# EAGLE schematic twip-pb1 (EAGLE 9.1.3)
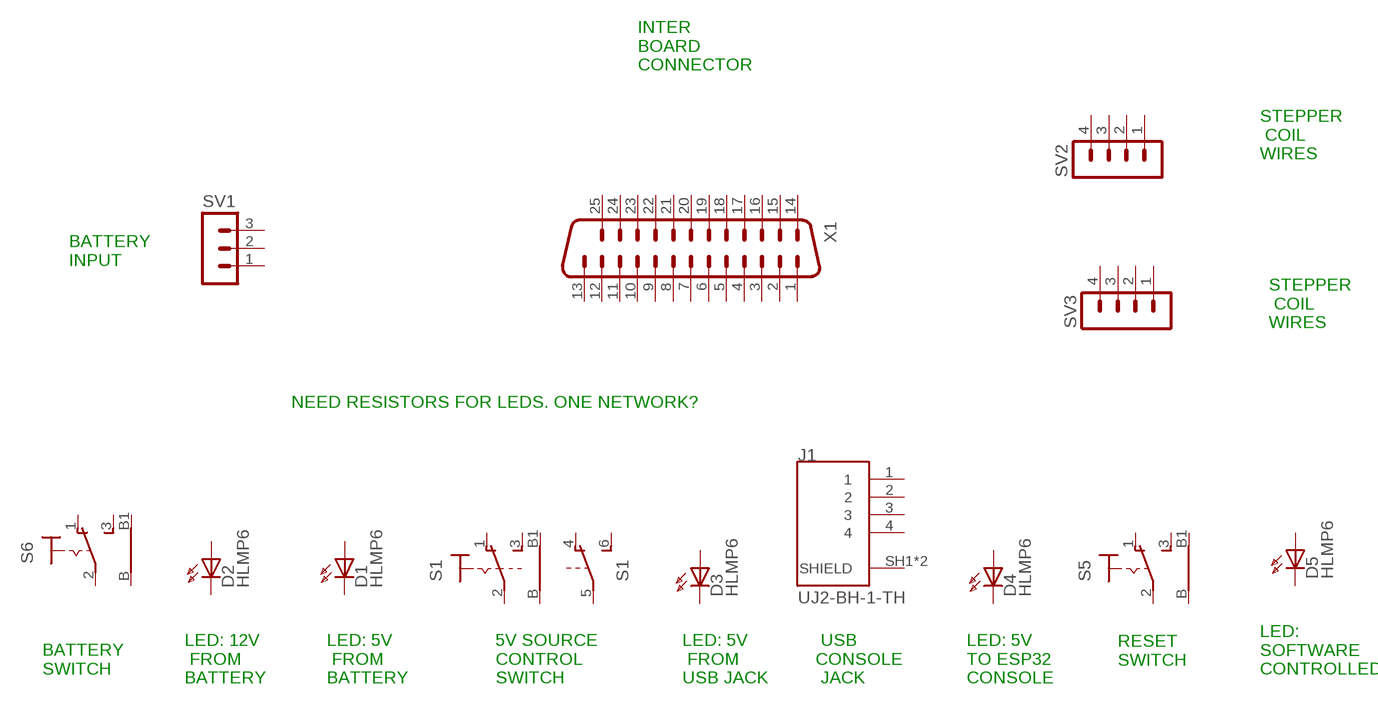
[diagram p0: schematic, sheet 1]

## Parts
D1  HLMP6  [HLMP6]
D2  HLMP6  [HLMP6]
D3  HLMP6  [HLMP6]
D4  HLMP6  [HLMP6]
D5  HLMP6  [HLMP6]
J1  UJ2-BH-1-TH  [CUI_UJ2-BH-1-TH]
S1  9070-2W  [9070-2W]
S5  9070-1W  [9070-1W]
S6  9070-1W  [9070-1W]
SV1  MA03-1  [MA03-1]
SV2  MA04-1  [MA04-1]
SV3  MA04-1  [MA04-1]
X1  M25VP  [M25VP]
Unconnected: D1.A D1.K D2.A D2.K D3.A D3.K D4.A D4.K D5.A D5.K J1.1 J1.2 J1.3 J1.4 J1.SH1(SHIELD) J1.SH2(SHIELD) S1.1(1:O) S1.2(1:P) S1.3(1:S) S1.4(B:O) S1.5(B:P) S1.6(B:S) S1.B1(1:B1) S1.B(1:B) S5.1(O) S5.2(P) S5.3(S) S5.B S5.B1 S6.1(O) S6.2(P) S6.3(S) S6.B S6.B1 SV1.1 SV1.2 SV1.3 SV2.1 SV2.2 SV2.3 SV2.4 SV3.1 SV3.2 SV3.3 SV3.4 X1.1 X1.2 X1.3 X1.4 X1.5 X1.6 X1.7 X1.8 X1.9 X1.10 X1.11 X1.12 X1.13 X1.14 X1.15 X1.16 X1.17 X1.18 X1.19 X1.20 X1.21 X1.22 X1.23 X1.24 X1.25 X1.G1 X1.G2

## Notes on the sheet
- INTER 
  BOARD 
  CONNECTOR
- STEPPER
   COIL
  WIRES
- BATTERY
  INPUT
- STEPPER
   COIL
  WIRES
- NEED RESISTORS FOR LEDS. ONE NETWORK?
- RESET
  SWITCH
- BATTERY 
  SWITCH
- LED: 
  SOFTWARE
  CONTROLLED
- LED: 12V
   FROM
  BATTERY
- LED: 5V
   FROM
  BATTERY
- 5V SOURCE
  CONTROL
  SWITCH
- LED: 5V
   FROM
  USB JACK
- USB
  CONSOLE
   JACK
- LED: 5V
  TO ESP32
  CONSOLE

## Library data of the parts
D1-D5 = display-hp:HLMP6: LED 2mm horizontal; MF: AGILENT TECHNOLOGIES; MPN: HLMP-6500; OC_FARNELL: 1652490; OC_NEWARK: 40K0088
J1 = UJ2-BH-1-TH:UJ2-BH-1-TH: 3 µin Plating Thickness, Black Insulator, USB Receptacle; MANUFACTURER: CUI INC; PART_REV: 1.0; STANDARD: MANUFACTURER RECOMENDATION
S1 = switch:9070-2W: TOGGLE SWITCH Marquardt
S5 S6 = switch:9070-1W: TOGGLE SWITCH Marquardt
SV1 = con-lstb:MA03-1: PIN HEADER; OC_FARNELL: unknown; OC_NEWARK: unknown
SV2 SV3 = con-lstb:MA04-1: PIN HEADER; OC_FARNELL: unknown; OC_NEWARK: unknown
X1 = con-subd:M25VP: SUB-D; OC_FARNELL: unknown; OC_NEWARK: unknown